# EAGLE design 328p_ ver2_basic_final (EAGLE 7.1.0)
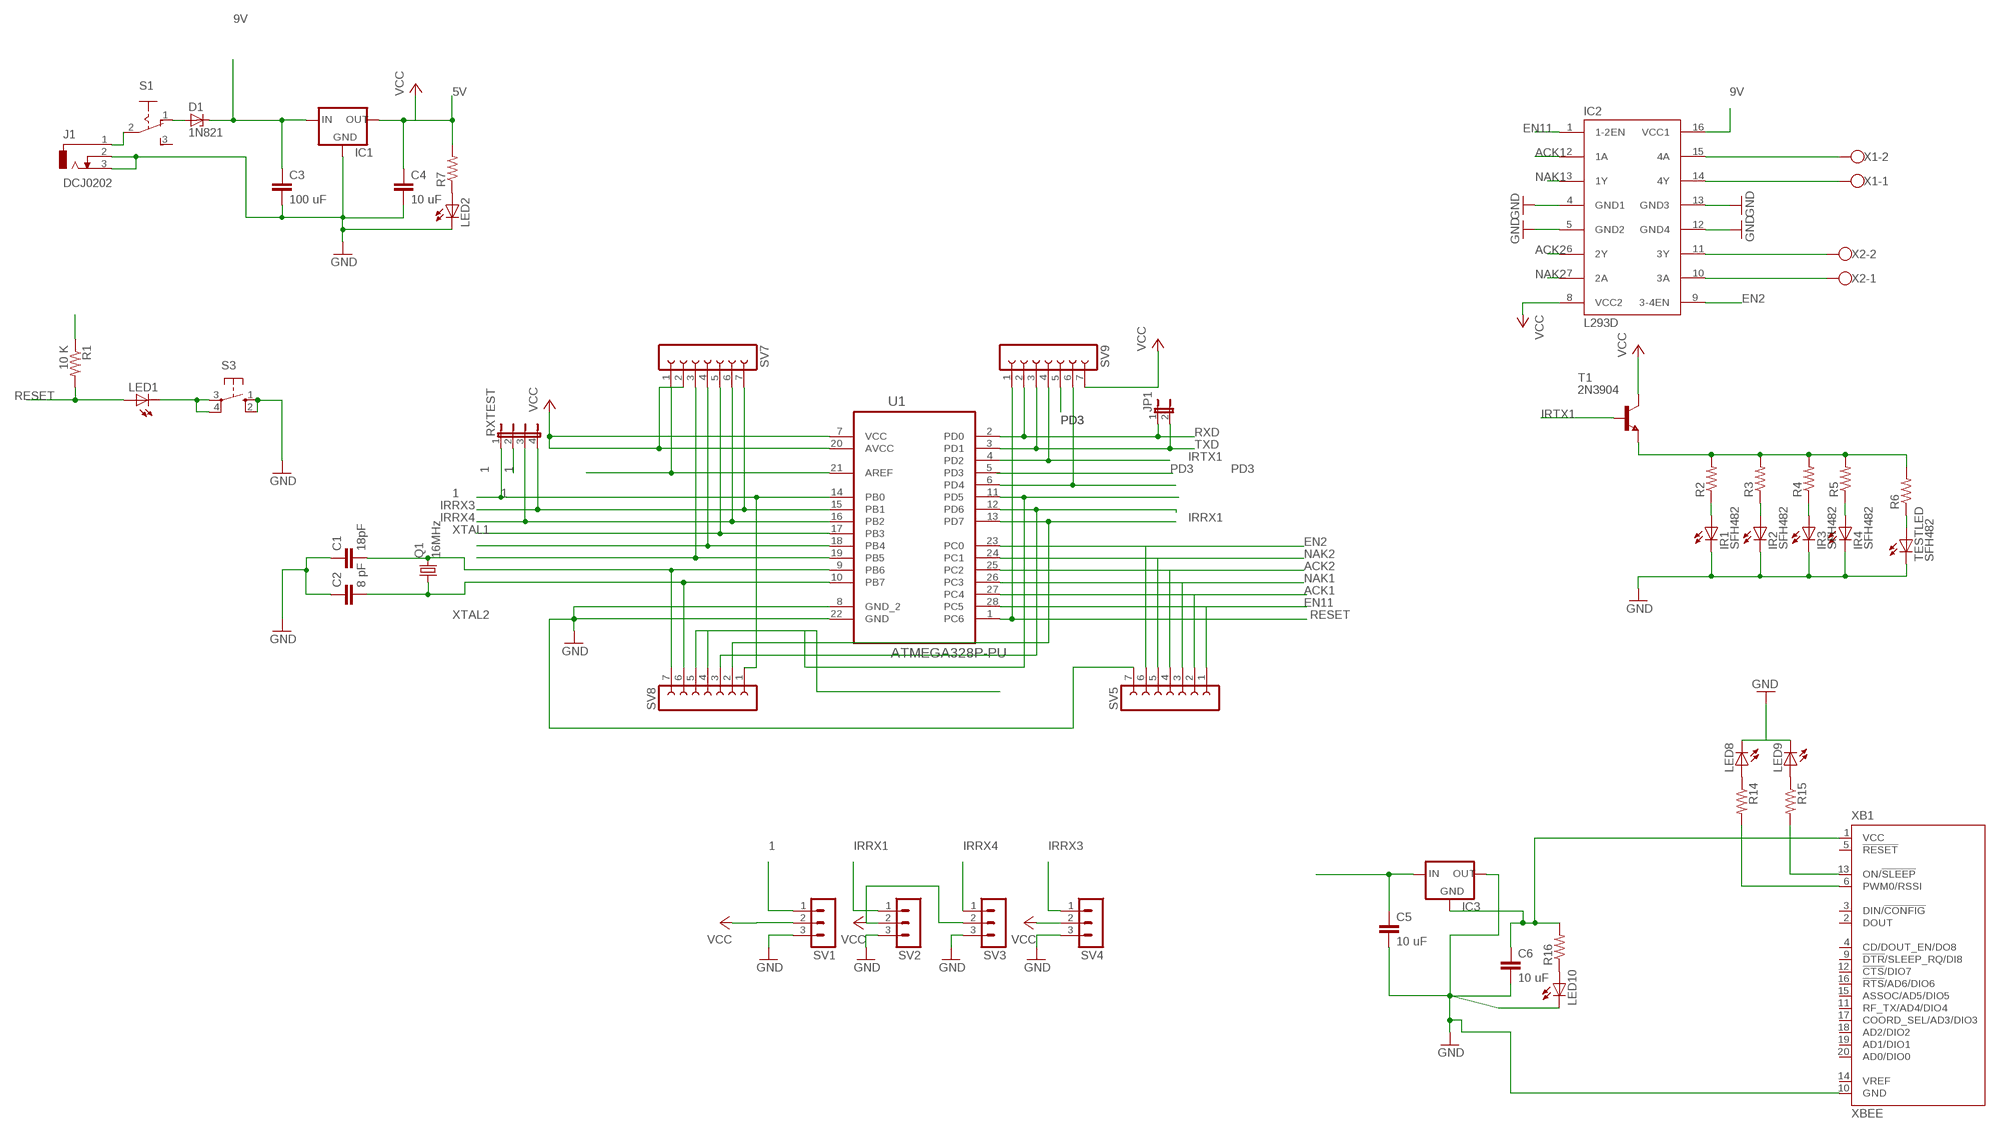
[diagram p0: schematic, sheet 1]

## Parts
C1  18pF  C2,5-3  [C2.5-3]
C2  8 pF  C2,5-3  [C2.5-3]
C3  100 uF  C2,5-3  [C2.5-3]
C4  10 uF  C2,5-3  [C2.5-3]
C5  10 uF  C2,5-3  [C2.5-3]
C6  10 uF  C2,5-3  [C2.5-3]
D1  1N821  [DO35Z10]
IC1  78XXS  [78XXS]
IC2  L293D  [DIL16]
IC3  78XXS  [78XXS]
IR1  SFH482  [SFH482]
IR2  SFH482  [SFH482]
IR3  SFH482  [SFH482]
IR4  SFH482  [SFH482]
J1  DCJ0202  [DCJ0202]
JP1  JP1E  [JP1]
LED1  LED3MM  [LED3MM]
LED2  LED3MM  [LED3MM]
LED8  LED3MM  [LED3MM]
LED9  LED3MM  [LED3MM]
LED10  LED3MM  [LED3MM]
Q1  16MHz  CRYSTALHC49S  [HC49/S]
R1  10 K  R-US_0207/12  [0207/12]
R2  R-US_0204/7  [0204/7]
R3  R-US_0204/7  [0204/7]
R4  R-US_0204/7  [0204/7]
R5  R-US_0204/7  [0204/7]
R6  R-US_0204/7  [0204/7]
R7  R-US_0204/7  [0204/7]
R14  R-US_0207/10  [0207/10]
R15  R-US_0207/10  [0207/10]
R16  R-US_0204/7  [0204/7]
RXTEST  JP4E  [JP4]
S1  255SB  [255SB]
S3  10-XX  [B3F-10XX]
SV1  MA03-1  [MA03-1]
SV2  MA03-1  [MA03-1]
SV3  MA03-1  [MA03-1]
SV4  MA03-1  [MA03-1]
SV5  FE07-1  [FE07]
SV7  FE07-1  [FE07]
SV8  FE07-1  [FE07]
SV9  FE07-1  [FE07]
T1  2N3904  [TO92]
TESTLED  SFH482  [SFH482]
U1  ATMEGA328P-PU  [DIP254P762X457-28]
X1  W237-102  [W237-102]
X2  W237-102  [W237-102]
XB1  XBEE  [XBEE]

## Nets
1: RXTEST.1 SV1.1 SV8.1 U1.14(PB0)
5V: C4.1 C5.1 IC1.OUT IC3.IN R1.1 R7.2 ; supply symbol labelled VCC
9V: C3.1 D1.C IC1.IN IC2.16(VCC1)
ACK1: IC2.2(1A) SV5.2 U1.27(PC4)
ACK2: IC2.6(2Y) SV5.4 U1.25(PC2)
EN1: SV8.5
EN2: IC2.9(3-4EN) SV5.6 U1.23(PC0)
EN11: IC2.1(1-2EN) SV5.1 U1.28(PC5)
GND: C1.1 C2.1 C3.2 C4.2 C5.2 C6.2 IC1.GND IC2.4(GND1) IC2.5(GND2) IC2.12(GND4) IC2.13(GND3) IC3.OUT IR1.K(C) IR2.K(C) IR3.K(C) IR4.K(C) J1.2 J1.3 LED2.K(C) LED8.K(C) LED9.K(C) LED10.K(C) S3.1(S) S3.2(S1) SV1.3 SV2.3 SV3.3 SV4.3 SV5.7 TESTLED.K(C) U1.8(GND_2) U1.22(GND) XB1.10(GND)
IRRX1: RXTEST.2 SV2.1 SV8.2 U1.13(PD7)
IRRX3: RXTEST.4 SV4.1 SV7.7 U1.15(PB1)
IRRX4: RXTEST.3 SV3.1 SV7.6 U1.16(PB2)
IRTX1: SV9.4 T1.2(B) U1.4(PD2)
N$1: IC2.15(4A) X1.2
N$2: IR1.A R2.1
N$3: IR2.A R3.1
N$4: IR3.A R4.1
N$5: IR4.A R5.1
N$6: R2.2 R3.2 R4.2 R5.2 R6.2 T1.3(E)
N$7: IC2.14(4Y) X1.1
N$8: IC2.11(3Y) X2.2
N$9: IC2.10(3A) X2.1
N$10: R6.1 TESTLED.A
N$11: LED2.A R7.1
N$13: J1.1 S1.2(P)
N$14: LED1.K(C) S3.3(P) S3.4(P1)
N$15: SV7.5 U1.17(PB3)
N$16: SV7.4 U1.18(PB4)
N$17: SV7.3 U1.19(PB5)
N$18: SV7.1 U1.21(AREF)
N$19: R15.2 XB1.13(ON/!SLEEP)
N$20: SV9.6 U1.6(PD4)
N$21: IC2.8(VCC2) SV1.2 SV2.2 SV3.2 SV4.2 SV7.2 SV9.7 T1.1(C) U1.7(VCC) U1.20(AVCC) ; supply symbol labelled VCC
N$23: D1.A S1.1(O)
N$25: SV8.3 U1.12(PD6)
N$28: LED10.A R16.1
N$29: C6.1 IC3.GND R16.2 XB1.1(VCC)
N$31: LED8.A R14.1
N$32: LED9.A R15.1
N$33: R14.2 XB1.6(PWM0/RSSI)
NAK1: IC2.3(1Y) SV5.3 U1.26(PC3)
NAK2: IC2.7(2A) SV5.5 U1.24(PC1)
PD3: SV9.5
PD5: SV8.4 U1.11(PD5)
RESET: LED1.A R1.2 SV9.1 U1.1(PC6)
RXD: JP1.1 SV9.2 U1.2(PD0)
TXD: JP1.2 SV9.3 U1.3(PD1)
XTAL1: C1.2 Q1.2 SV8.7 U1.9(PB6)
XTAL2: C2.2 Q1.1 SV8.6 U1.10(PB7)
Unconnected: S1.3(S) U1.5(PD3) XB1.2(DOUT) XB1.3(DIN/!CONFIG) XB1.4(CD/DOUT_EN/DO8) XB1.5(!RESET) XB1.9(!DTR!/SLEEP_RQ/DI8) XB1.11(RF_TX/AD4/DIO4) XB1.12(!CTS!/DIO7) XB1.14(VREF) XB1.15(ASSOC/AD5/DIO5) XB1.16(!RTS!/AD6/DIO6) XB1.17(COORD_SEL/AD3/DIO3) XB1.18(AD2/DIO2) XB1.19(AD1/DIO1) XB1.20(AD0/DIO0)

## Library data of the parts
C1-C6 = capacitor-wima:C: CAPACITOR naming: grid - package width
D1 = diode:1N821: Reference DIODE temperature compensated, 6,2 V
IC1 IC3 = v-reg:78XXS: VOLTAGE REGULATOR
IC2 = st-microelectronics:L293D: PUSH-PULL 4 CHANNEL DRIVER; MPN: L293D; OC_FARNELL: 9589619; OC_NEWARK: 56P8249
IR1-IR4 TESTLED = led:SFH482: IR LED infrared emitting diode, Infineon
J1 = con-jack:DCJ0202: DC POWER JACK Source: DCJ0202.pdf; OC_FARNELL: unknown; OC_NEWARK: unknown
JP1 = jumper:JP1E: JUMPER
LED1 LED2 LED8-LED10 = led:LED: LED OSRAM: - CHIPLED LG R971, LG N971, LY N971, LG Q971, LY Q971, LO R971, LY R971 LH N974, LH R974 LS Q976, LO Q976, LY Q976 LO Q996 - Hyper CHIPLED LW Q18S LB Q993, LB Q99A, LB R99A - SideLED LS A670, LO A670, LY A670, LG A670, LP A670 LB A673, LV A673, LT A673, LW A673 LH A674 LY A675 LS A676, LA A676, LO A676, LY A676, LW A676 LS A679, LY A679, LG A679 - Hyper Micro SIDELED® LS Y876, LA Y876, LO Y876, LY Y876 LT Y87S - SmartLED LW L88C, LW L88S LB L89C, LB L89S, LG L890 LS L89K, LO L89K, LY L89K LS L896, LA L896, LO L896, LY L896 - TOPLED LS T670, LO T670, LY T670, LG T670, LP T670 LSG T670, LSP T670, LSY T670, LOP T670, LYG T670 LG T671, LOG T671, LSG T671 LB T673, LV T673, LT T673, LW T673 LH T674 LS T676, LA T676, LO T676, LY T676, LB T676, LH T676, LSB T676, LW T676 LB T67C, LV T67C, LT T67C, LS T67K, LO T67K, LY T67K, LW E67C LS E67B, LA E67B, LO E67B, LY E67B, LB E67C, LV E67C, LT E67C LW T67C LS T679, LY T679, LG T679 LS T770, LO T770, LY T770, LG T770, LP T770 LB T773, LV T773, LT T773, LW T773 LH T774 LS E675, LA E675, LY E675, LS T675 LS T776, LA T776, LO T776, LY T776, LB T776 LHGB T686 LT T68C, LB T68C - Hyper Mini TOPLED® LB M676 - Mini TOPLED Santana® LG M470 LS M47K, LO M47K, LY M47K Source: http://www.osram.convergy.de LUXEON: - LUMILED® LXK2-PW12-R00, LXK2-PW12-S00, LXK2-PW14-U00, LXK2-PW14-V00 LXK2-PM12-R00, LXK2-PM12-S00, LXK2-PM14-U00 LXK2-PE12-Q00, LXK2-PE12-R00, LXK2-PE12-S00, LXK2-PE14-T00, LXK2-PE14-U00 LXK2-PB12-K00, LXK2-PB12-L00, LXK2-PB12-M00, LXK2-PB14-N00, LXK2-PB14-P00, LXK2-PB14-Q00 LXK2-PR12-L00, LXK2-PR12-M00, LXK2-PR14-Q00, LXK2-PR14-R00 LXK2-PD12-Q00, LXK2-PD12-R00, LXK2-PD12-S00 LXK2-PH12-R00, LXK2-PH12-S00 LXK2-PL12-P00, LXK2-PL12-Q00, LXK2-PL12-R00 Source: www.luxeon.com KINGBRIGHT: KA-3528ASYC Source: www.kingbright.com
Q1 = crystal:CRYSTAL: CRYSTAL; OC_FARNELL: 1667008; OC_NEWARK: unknown
R1-R7 R16 = resistor:R-US_: RESISTOR, American symbol
R14 R15 = rcl:R-US_: RESISTOR, American symbol
RXTEST = jumper:JP4E: JUMPER
S1 = switch:255SB: SLIDING SWITCH Distributor Buerklin, 11G810
S3 = switch-omron:10-XX: OMRON SWITCH; MPN: B3F-1000; OC_FARNELL: 176432; OC_NEWARK: 36M3542
SV1-SV4 = con-lstb:MA03-1: PIN HEADER; OC_FARNELL: unknown; OC_NEWARK: unknown
SV5 SV7-SV9 = con-lsta:FE07-1: FEMALE HEADER; OC_FARNELL: unknown; OC_NEWARK: unknown
T1 = transistor:2N3904: NPN TRANSISTOR
U1 = Atmel_By_element14_Batch_1-00:ATMEGA328P-PU: 8-bit Microcontroller with In-System Programmable Flash; MPN: ATMEGA328P-PU; OC_FARNELL: 1715487; OC_NEWARK: 15R0268; PACKAGE: PDIP-28; SUPPLIER: Atmel
X1 X2 = con-wago-500:W237-102: WAGO SCREW CLAMP; MPN: 237-102; OC_FARNELL: unknown; OC_NEWARK: 70K9898
XB1 = maxstream:XBEE: XBee (TM) /XBee-PRO(TM) OEM RF Modules Source: MaxStream, Inc. xbee_productmanual.pdf; MPN: XBP24-Z7UIT-004; OC_FARNELL: 1751799; OC_NEWARK: 34R5507

## Board
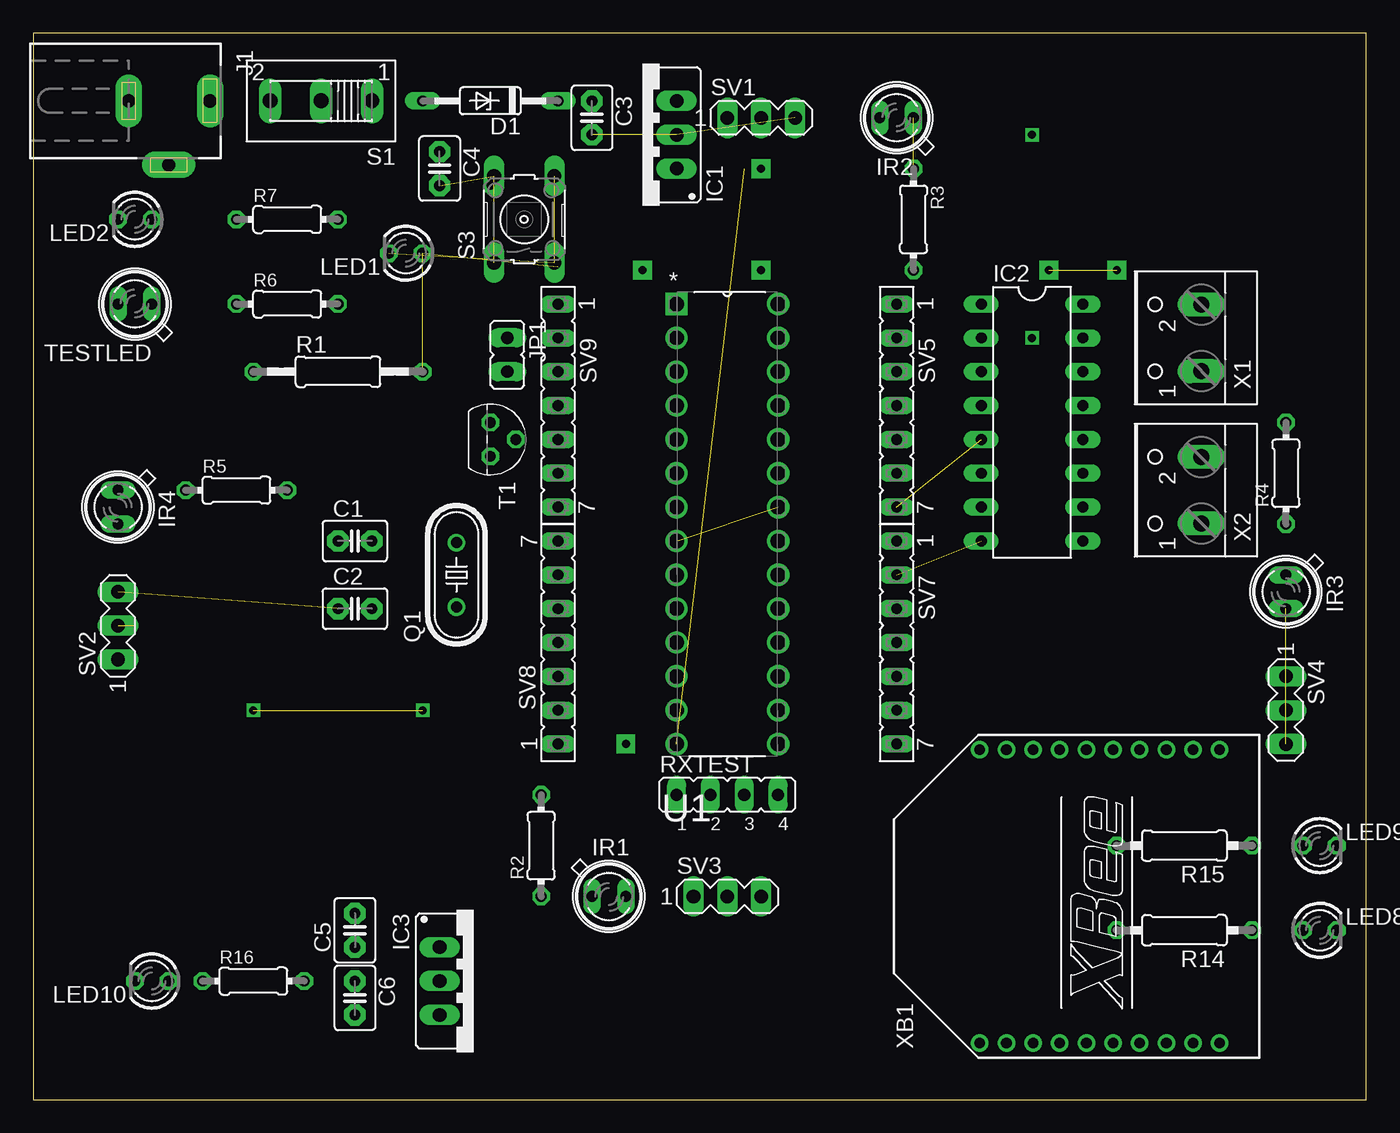
[diagram p1: board, top side]
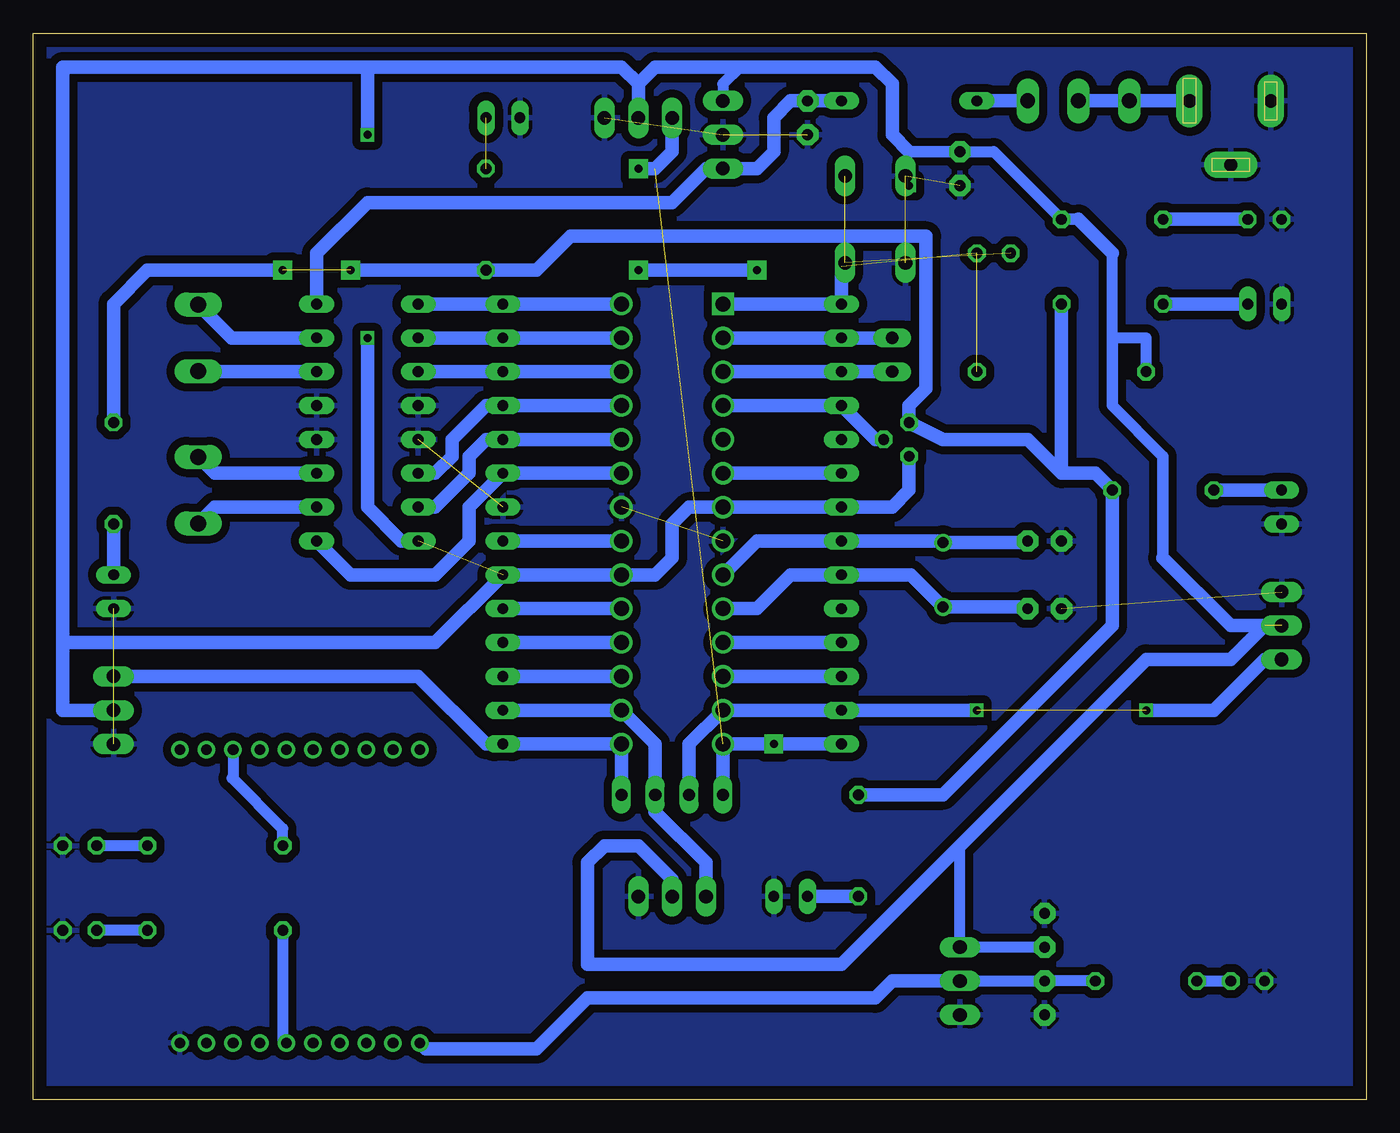
[diagram p2: board, bottom side, seen from below]

Size 100 x 80 mm. Coordinates in mm from the lower left corner, seen from the top.
Outline: 0,0 100,0 100,80 0,80 0,0
Copper layers (1*16): Top 0.035mm / dielectric 1.5mm / Bottom 0.035mm
Design rules "default": minimum track width 10mil, minimum drill 24mil, track to track 8mil, track to pad 8mil, pad to pad 8mil, via to via 8mil, smd to smd 8mil, copper to edge 40mil, drill to drill 8mil, minimum pad ring 10mil, minimum via ring 8mil, stop-mask expansion 4mil, vias tented up to drill 0mil, thermal gap 10mil

### Footprints (pad centres in the part's own frame; a part is rotated, then mirrored left to right if it is on the bottom)
C2.5-3 = drill 0.813 pad 1.6 octagon: 1 -1.27,0; 2 1.27,0
DO35Z10 = drill 0.813 long: A 5.08,0; C -5.08,0
78XXS = drill 1.016 long: GND 0,-2.54; IN -2.54,-2.54; OUT 2.54,-2.54
DIL16 = drill 0.813 long: 1 -8.89,-3.81; 2 -6.35,-3.81; 3 -3.81,-3.81; 4 -1.27,-3.81; 5 1.27,-3.81; 6 3.81,-3.81; 7 6.35,-3.81; 8 8.89,-3.81; 9 8.89,3.81; 10 6.35,3.81; 11 3.81,3.81; 12 1.27,3.81; 13 -1.27,3.81; 14 -3.81,3.81; 15 -6.35,3.81; 16 -8.89,3.81
SFH482 = drill 0.813 long: A -1.27,0; K 1.27,0
DCJ0202 = drill 1 pad 2 long: 1 0,3.1; 2 4.8,0; 3 0,-3
JP1 = drill 0.914 long: 1 0,-1.27; 2 0,1.27
LED3MM = drill 0.813 octagon: A -1.27,0; K 1.27,0
HC49/S = drill 0.813: 1 -2.413,0; 2 2.413,0
0207/12 = drill 0.813 octagon: 1 -6.35,0; 2 6.35,0
0204/7 = drill 0.813 octagon: 1 -3.81,0; 2 3.81,0
0207/10 = drill 0.813 octagon: 1 -5.08,0; 2 5.08,0
JP4 = drill 0.914 long: 1 -3.81,0; 2 -1.27,0; 3 1.27,0; 4 3.81,0
255SB = drill 1.118 long: 1 -3.81,0; 2 0,0; 3 3.81,0
B3F-10XX = drill 1.016 long: 1 -3.251,2.261; 2 3.251,2.261; 3 -3.251,-2.261; 4 3.251,-2.261
MA03-1 = drill 1.016 long: 1 -2.54,0; 2 0,0; 3 2.54,0
FE07 = drill 0.813 long: 1 -7.62,0; 2 -5.08,0; 3 -2.54,0; 4 0,0; 5 2.54,0; 6 5.08,0; 7 7.62,0
TO92 = drill 0.813 octagon: 1 1.27,0; 2 0,1.905; 3 -1.27,0
DIP254P762X457-28 = drill 1.118 square: 1 -7.62,33.02 | drill 1.118: 2 -7.62,30.48; 3 -7.62,27.94; 4 -7.62,25.4; 5 -7.62,22.86; 6 -7.62,20.32; 7 -7.62,17.78; 8 -7.62,15.24; 9 -7.62,12.7; 10 -7.62,10.16; 11 -7.62,7.62; 12 -7.62,5.08; 13 -7.62,2.54; 14 -7.62,0; 15 0,0; 16 0,2.54; 17 0,5.08; 18 0,7.62; 19 0,10.16; 20 0,12.7; 21 0,15.24; 22 0,17.78; 23 0,20.32; 24 0,22.86; 25 0,25.4; 26 0,27.94; 27 0,30.48; 28 0,33.02
W237-102 = drill 1.194 long: 1 -2.5,-1.27; 2 2.5,-1.27
XBEE = drill 0.8 pad 1.27: 1 -11,9; 2 -11,7; 3 -11,5; 4 -11,3; 5 -11,1; 6 -11,-1; 7 -11,-3; 8 -11,-5; 9 -11,-7; 10 -11,-9; 11 11,-9; 12 11,-7; 13 11,-5; 14 11,-3; 15 11,-1; 16 11,1; 17 11,3; 18 11,5; 19 11,7; 20 11,9

### Placement (x,y rotation side)
C1  24.13,41.91 0 top
C2  24.13,36.83 0 top
C3  41.91,73.66 270 top
C4  30.48,69.85 270 top
C5  24.13,12.7 90 top
C6  24.13,7.62 270 top
D1  34.29,74.93 180 top
IC1  45.72,72.39 90 top
IC2  74.93,50.8 270 top
IC3  33.02,8.89 270 top
IR1  43.18,15.24 0 top
IR2  64.77,73.66 180 top
IR3  93.98,38.1 270 top
IR4  6.35,44.45 270 top
J1  10.16,74.93 270 top
JP1  35.56,55.88 180 top
LED1  27.94,63.5 180 top
LED2  7.62,66.04 180 top
LED8  96.52,12.7 0 top
LED9  96.52,19.05 0 top
LED10  8.89,8.89 180 top
Q1  31.75,39.37 90 top
R1  22.86,54.61 0 top
R2  38.1,19.05 90 top
R3  66.04,66.04 270 top
R4  93.98,46.99 90 top
R5  15.24,45.72 0 top
R6  19.05,59.69 0 top
R7  19.05,66.04 0 top
R14  86.36,12.7 180 top
R15  86.36,19.05 180 top
R16  16.51,8.89 0 top
RXTEST  52.07,22.86 0 top
S1  21.59,74.93 180 top
S3  36.83,66.04 90 top
SV1  54.61,73.66 0 top
SV2  6.35,35.56 90 top
SV3  52.07,15.24 0 top
SV4  93.98,29.21 270 top
SV5  64.77,52.07 270 top
SV7  64.77,34.29 270 top
SV8  39.37,34.29 90 top
SV9  39.37,52.07 270 top
T1  34.29,49.53 270 top
TESTLED  7.62,59.69 180 top
U1  55.88,26.67 0 top
X1  86.36,57.15 90 top
X2  86.36,45.72 90 top
XB1  80.01,15.24 90 top

### Tracks (layer width: path | path; a pad name or v marks a point on that pad's centre or on a via)
1  (via drill 0.6 pad 1.42)  (1 unrouted)
  Bottom 1.016: SV8.1 v44.45,26.67 U1.14 RXTEST.1 | SV1.1 52.07,71.12 53.34,69.85 54.61,69.85
5V
  Bottom 0.813: 19.05,57.15 19.05,63.5 21.59,66.04 R7.2 27.94,71.12 C4.1 34.29,71.12 35.56,72.39 35.56,76.2 36.83,77.47 46.99,77.47 48.26,76.2 IC1.OUT | C5.1 IC3.IN 30.48,19.05 16.51,33.02 10.16,33.02 7.62,35.56 10.16,35.56 15.24,40.64 15.24,48.26 19.05,52.07 19.05,57.15 | R1.1 16.51,57.15 19.05,57.15
9V
  Bottom 1.016: D1.C C3.1 43.18,74.93 44.45,73.66 44.45,71.12 45.72,69.85 IC1.IN 49.53,69.85 52.07,67.31 74.93,67.31 78.74,63.5 IC2.16
ACK1
  Bottom 1.016: U1.27 SV5.2 IC2.2
ACK2
  Bottom 1.016: U1.25 SV5.4 66.04,52.07 68.58,49.53 68.58,48.26 69.85,46.99 IC2.6
EN2
  Bottom 1.016: U1.23 SV5.6 67.31,44.45 67.31,41.91 69.85,39.37 76.2,39.37 IC2.9
EN11
  Bottom 1.016: U1.28 SV5.1 IC2.1
GND  (8 unrouted)
  pour Bottom (isolate 0.61): 0,0 0,80.01 100.33,80.01 100.33,0
IRRX1  (via drill 0.6)  (1 unrouted)
  Bottom 1.016: SV2.1 7.62,33.02 11.43,29.21 v16.51,29.21 | 29.21,29.21 SV8.2 U1.13 50.8,26.67 RXTEST.2
IRRX3
  Bottom 1.016: RXTEST.4 U1.15 SV7.7 66.04,26.67 71.12,31.75 SV4.1
IRRX4
  Bottom 1.016: SV7.6 U1.16 53.34,26.67 RXTEST.3 53.34,21.59 49.53,17.78 SV3.1
IRTX1
  Bottom 1.016: U1.4 SV9.4 36.83,49.53 T1.2
N$1
  Bottom 1.016: IC2.15 85.13,57.15 X1.2
N$2
  Bottom 1.016: IR1.A R2.1
N$3  (1 unrouted)
N$4
  Bottom 1.016: R4.1 IR3.A
N$5
  Bottom 1.016: R5.1 IR4.A
N$6  (via drill 0.6 pad 1.42)  (1 unrouted)
  Bottom 1.016: 22.86,46.99 20.32,46.99 R5.2 19.05,35.56 31.75,22.86 R2.2 | 22.86,46.99 25.4,49.53 31.75,49.53 T1.3 34.29,52.07 33.02,53.34 33.02,64.77 59.69,64.77 62.23,62.23 R3.2 v76.2,62.23 | R6.2 22.86,46.99 | R4.2 93.98,59.69 91.44,62.23 81.28,62.23
N$7
  Bottom 1.016: IC2.14 87.63,54.61 X1.1
N$8
  Bottom 1.016: IC2.11 86.4,46.99 X2.2
N$9
  Bottom 1.016: IC2.10 86.4,44.45 X2.1
N$10
  Bottom 1.016: R6.1 TESTLED.A
N$11
  Bottom 1.016: LED2.A R7.1
N$12  (via drill 0.6)
  other vias: 29.21,29.21
N$13
  Bottom 1.016: J1.1 S1.2
N$14  (2 unrouted)
N$15
  Bottom 1.016: U1.17 SV7.5
N$16
  Bottom 1.016: U1.18 SV7.4
N$17
  Bottom 1.016: U1.19 SV7.3
N$18
  Bottom 1.016: U1.21 SV7.1
N$19
  Bottom 0.813: XB1.13 85.01,24.21 85.09,24.13 81.28,20.32 R15.2
N$20
  Bottom 1.016: U1.6 SV9.6
N$21  (via drill 0.6)  (2 unrouted)
  Bottom 0.813: 15.24,40.64 15.24,48.26 19.05,52.07 19.05,63.5 | 21.59,66.04 22.86,66.04 27.94,71.12 34.29,71.12
  Bottom 1.016: 97.79,34.29 97.79,77.47 74.93,77.47 | 54.61,76.2 55.88,77.47 74.93,77.47 | 54.61,76.2 SV1.2 | 54.61,76.2 53.34,77.47 36.83,77.47 35.56,76.2 35.56,72.39 34.29,71.12 | SV3.2 52.07,16.51 54.61,19.05 57.15,19.05 58.42,17.78 58.42,10.16 39.37,10.16 16.51,33.02 10.16,33.02 7.62,35.56 10.16,35.56 15.24,40.64 | 21.59,66.04 19.05,63.5 | T1.1 34.29,45.72 35.56,44.45 SV9.7 U1.7 50.8,44.45 52.07,43.18 52.07,40.64 53.34,39.37 U1.20 SV7.2 69.85,34.29 97.79,34.29 | IC2.8 72.39,41.91 74.93,44.45 v74.93,57.15 | v74.93,72.39 74.93,77.47 | SV4.2 97.79,29.21 97.79,34.29
N$22  (via drill 0.6 pad 1.42)
  other vias: 81.28,62.23
N$23
  Bottom 1.016: S1.1 D1.A
N$24  (via drill 0.6)
  other vias: 34.29,68.58
N$25
  Bottom 1.016: SV8.3 U1.12
N$26  (via drill 0.6 pad 1.42)
  other vias: 54.61,69.85
N$27  (via drill 0.6 pad 1.42)
  Bottom 1.016: v54.61,62.23 v45.72,62.23
N$28
  Bottom 0.813: R16.1 LED10.A
N$29
  Bottom 0.813: IC3.GND C6.1 R16.2
  Bottom 1.016: IC3.GND 35.56,8.89 36.83,7.62 58.42,7.62 62.23,3.81 70.58,3.81 XB1.1
N$31
  Bottom 0.813: R14.1 LED8.A
N$32
  Bottom 0.813: R15.1 LED9.A
N$33
  Bottom 0.813: R14.2 81.28,4.51 XB1.6
NAK1
  Bottom 1.016: U1.26 SV5.3 IC2.3
NAK2
  Bottom 1.016: U1.24 SV5.5 66.04,49.53 67.31,48.26 67.31,46.99 69.85,44.45 IC2.7
PD5
  Bottom 1.016: U1.11 SV8.4
RESET  (2 unrouted)
  Bottom 1.016: U1.1 SV9.1 39.37,62.51
RXD
  Bottom 1.016: U1.2 SV9.2 JP1.1
TXD
  Bottom 1.016: U1.3 SV9.3 JP1.2
XTAL1
  Bottom 1.016: C1.2 25.53,41.78 Q1.2 31.88,41.91 SV8.7 45.72,41.91 U1.9
XTAL2
  Bottom 1.016: C2.2 25.53,36.96 Q1.1 34.16,39.37 SV8.6 43.18,39.37 45.72,36.83 U1.10